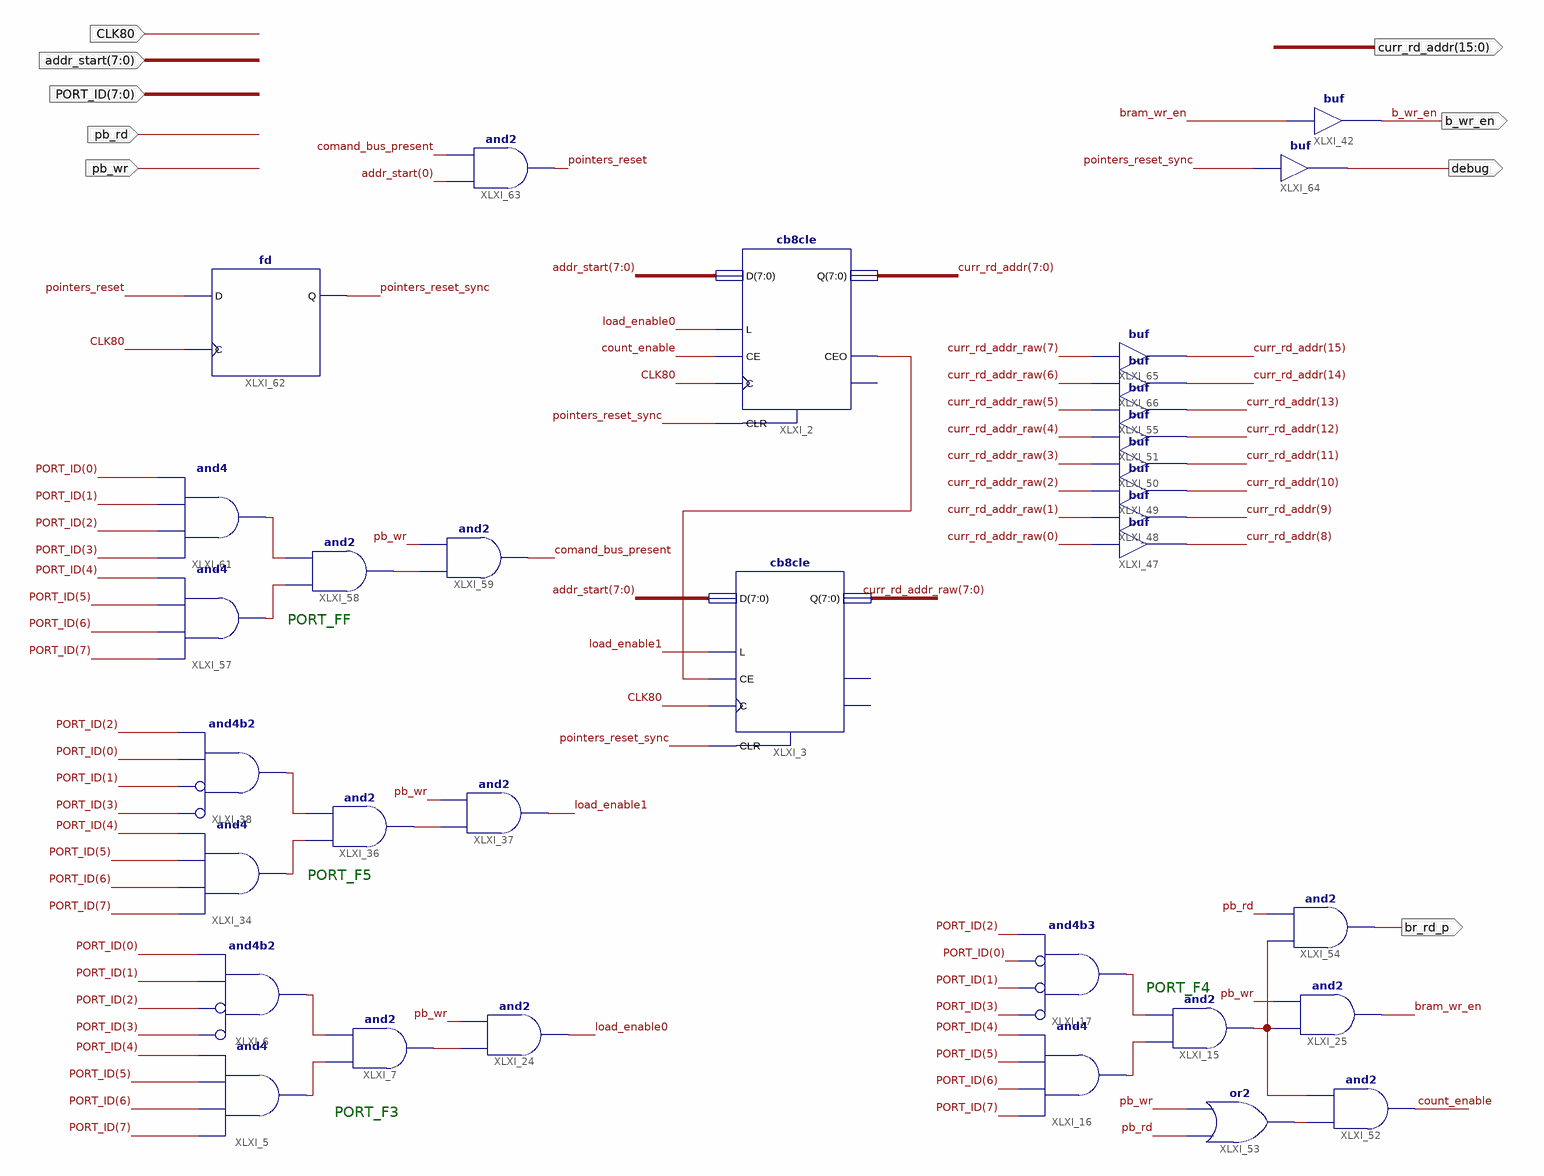
[diagram p0: schematic sheet 1]
// Xilinx ISE schematic autoinc_bramAddr.sch (spartan6) as structural Verilog: 33 symbols, 9 ports
module autoinc_bramAddr (
  input  CLK80,
  input  pb_wr,
  input  [7:0] PORT_ID,
  input  pb_rd,
  input  [7:0] addr_start,
  output [15:0] curr_rd_addr,
  output b_wr_en,
  output br_rd_p,
  output debug
);

  wire bram_wr_en, comand_bus_present, count_enable, load_enable0, load_enable1, pointers_reset,
       pointers_reset_sync, XLXN_32, XLXN_33, XLXN_75, XLXN_77, XLXN_114, XLXN_155, XLXN_170, XLXN_171,
       XLXN_180, XLXN_182, XLXN_192, XLXN_199, XLXN_200, XLXN_209;
  wire [7:0] curr_rd_addr_raw;

  and XLXI_15 (XLXN_182, XLXN_77, XLXN_75);
  and XLXI_16 (XLXN_77, PORT_ID[7], PORT_ID[6], PORT_ID[5], PORT_ID[4]);
  and XLXI_17 (XLXN_75, ~PORT_ID[3], ~PORT_ID[1], ~PORT_ID[0], PORT_ID[2]);  // and4b3
  and XLXI_5 (XLXN_33, PORT_ID[7], PORT_ID[6], PORT_ID[5], PORT_ID[4]);
  and XLXI_6 (XLXN_32, ~PORT_ID[3], ~PORT_ID[2], PORT_ID[1], PORT_ID[0]);  // and4b2
  and XLXI_7 (XLXN_114, XLXN_33, XLXN_32);
  and XLXI_24 (load_enable0, XLXN_114, pb_wr);
  and XLXI_25 (bram_wr_en, XLXN_182, pb_wr);
  cb8cle XLXI_3 (
    .C(CLK80), .CE(XLXN_155), .CLR(pointers_reset_sync), .D(addr_start), .L(load_enable1),
    .Q(curr_rd_addr_raw));  // open: CEO, TC
  and XLXI_34 (XLXN_171, PORT_ID[7], PORT_ID[6], PORT_ID[5], PORT_ID[4]);
  and XLXI_36 (XLXN_180, XLXN_171, XLXN_170);
  and XLXI_37 (load_enable1, XLXN_180, pb_wr);
  and XLXI_38 (XLXN_170, ~PORT_ID[3], ~PORT_ID[1], PORT_ID[0], PORT_ID[2]);  // and4b2
  buf XLXI_42 (b_wr_en, bram_wr_en);
  buf XLXI_47 (curr_rd_addr[8], curr_rd_addr_raw[0]);
  buf XLXI_48 (curr_rd_addr[9], curr_rd_addr_raw[1]);
  buf XLXI_49 (curr_rd_addr[10], curr_rd_addr_raw[2]);
  buf XLXI_50 (curr_rd_addr[11], curr_rd_addr_raw[3]);
  buf XLXI_51 (curr_rd_addr[12], curr_rd_addr_raw[4]);
  and XLXI_52 (count_enable, XLXN_192, XLXN_182);
  or XLXI_53 (XLXN_192, pb_rd, pb_wr);
  and XLXI_54 (br_rd_p, XLXN_182, pb_rd);
  buf XLXI_55 (curr_rd_addr[13], curr_rd_addr_raw[5]);
  and XLXI_57 (XLXN_200, PORT_ID[7], PORT_ID[6], PORT_ID[5], PORT_ID[4]);
  and XLXI_58 (XLXN_209, XLXN_200, XLXN_199);
  and XLXI_59 (comand_bus_present, XLXN_209, pb_wr);
  and XLXI_61 (XLXN_199, PORT_ID[3], PORT_ID[2], PORT_ID[1], PORT_ID[0]);
  cb8cle XLXI_2 (
    .C(CLK80), .CE(count_enable), .CLR(pointers_reset_sync), .D(addr_start), .L(load_enable0),
    .CEO(XLXN_155), .Q(curr_rd_addr[7:0]));  // open: TC
  fd XLXI_62 (.C(CLK80), .D(pointers_reset), .Q(pointers_reset_sync));
  and XLXI_63 (pointers_reset, addr_start[0], comand_bus_present);
  buf XLXI_64 (debug, pointers_reset_sync);
  buf XLXI_66 (curr_rd_addr[14], curr_rd_addr_raw[6]);
  buf XLXI_65 (curr_rd_addr[15], curr_rd_addr_raw[7]);

  // Notes on the sheet:
  //   PORT_FF
  //   PORT_F5
  //   PORT_F4
  //   PORT_F3
endmodule
